# Altium schematic sheet 501_GridPos5.SchDoc
size A2; Organization: Greenfield Tech Solutions; Address1: Molendreef 33; Address2: Ossendrecht; Address3: 4641CS; Address4: The Netherlands; SheetNumber: 5; SheetTotal: 7
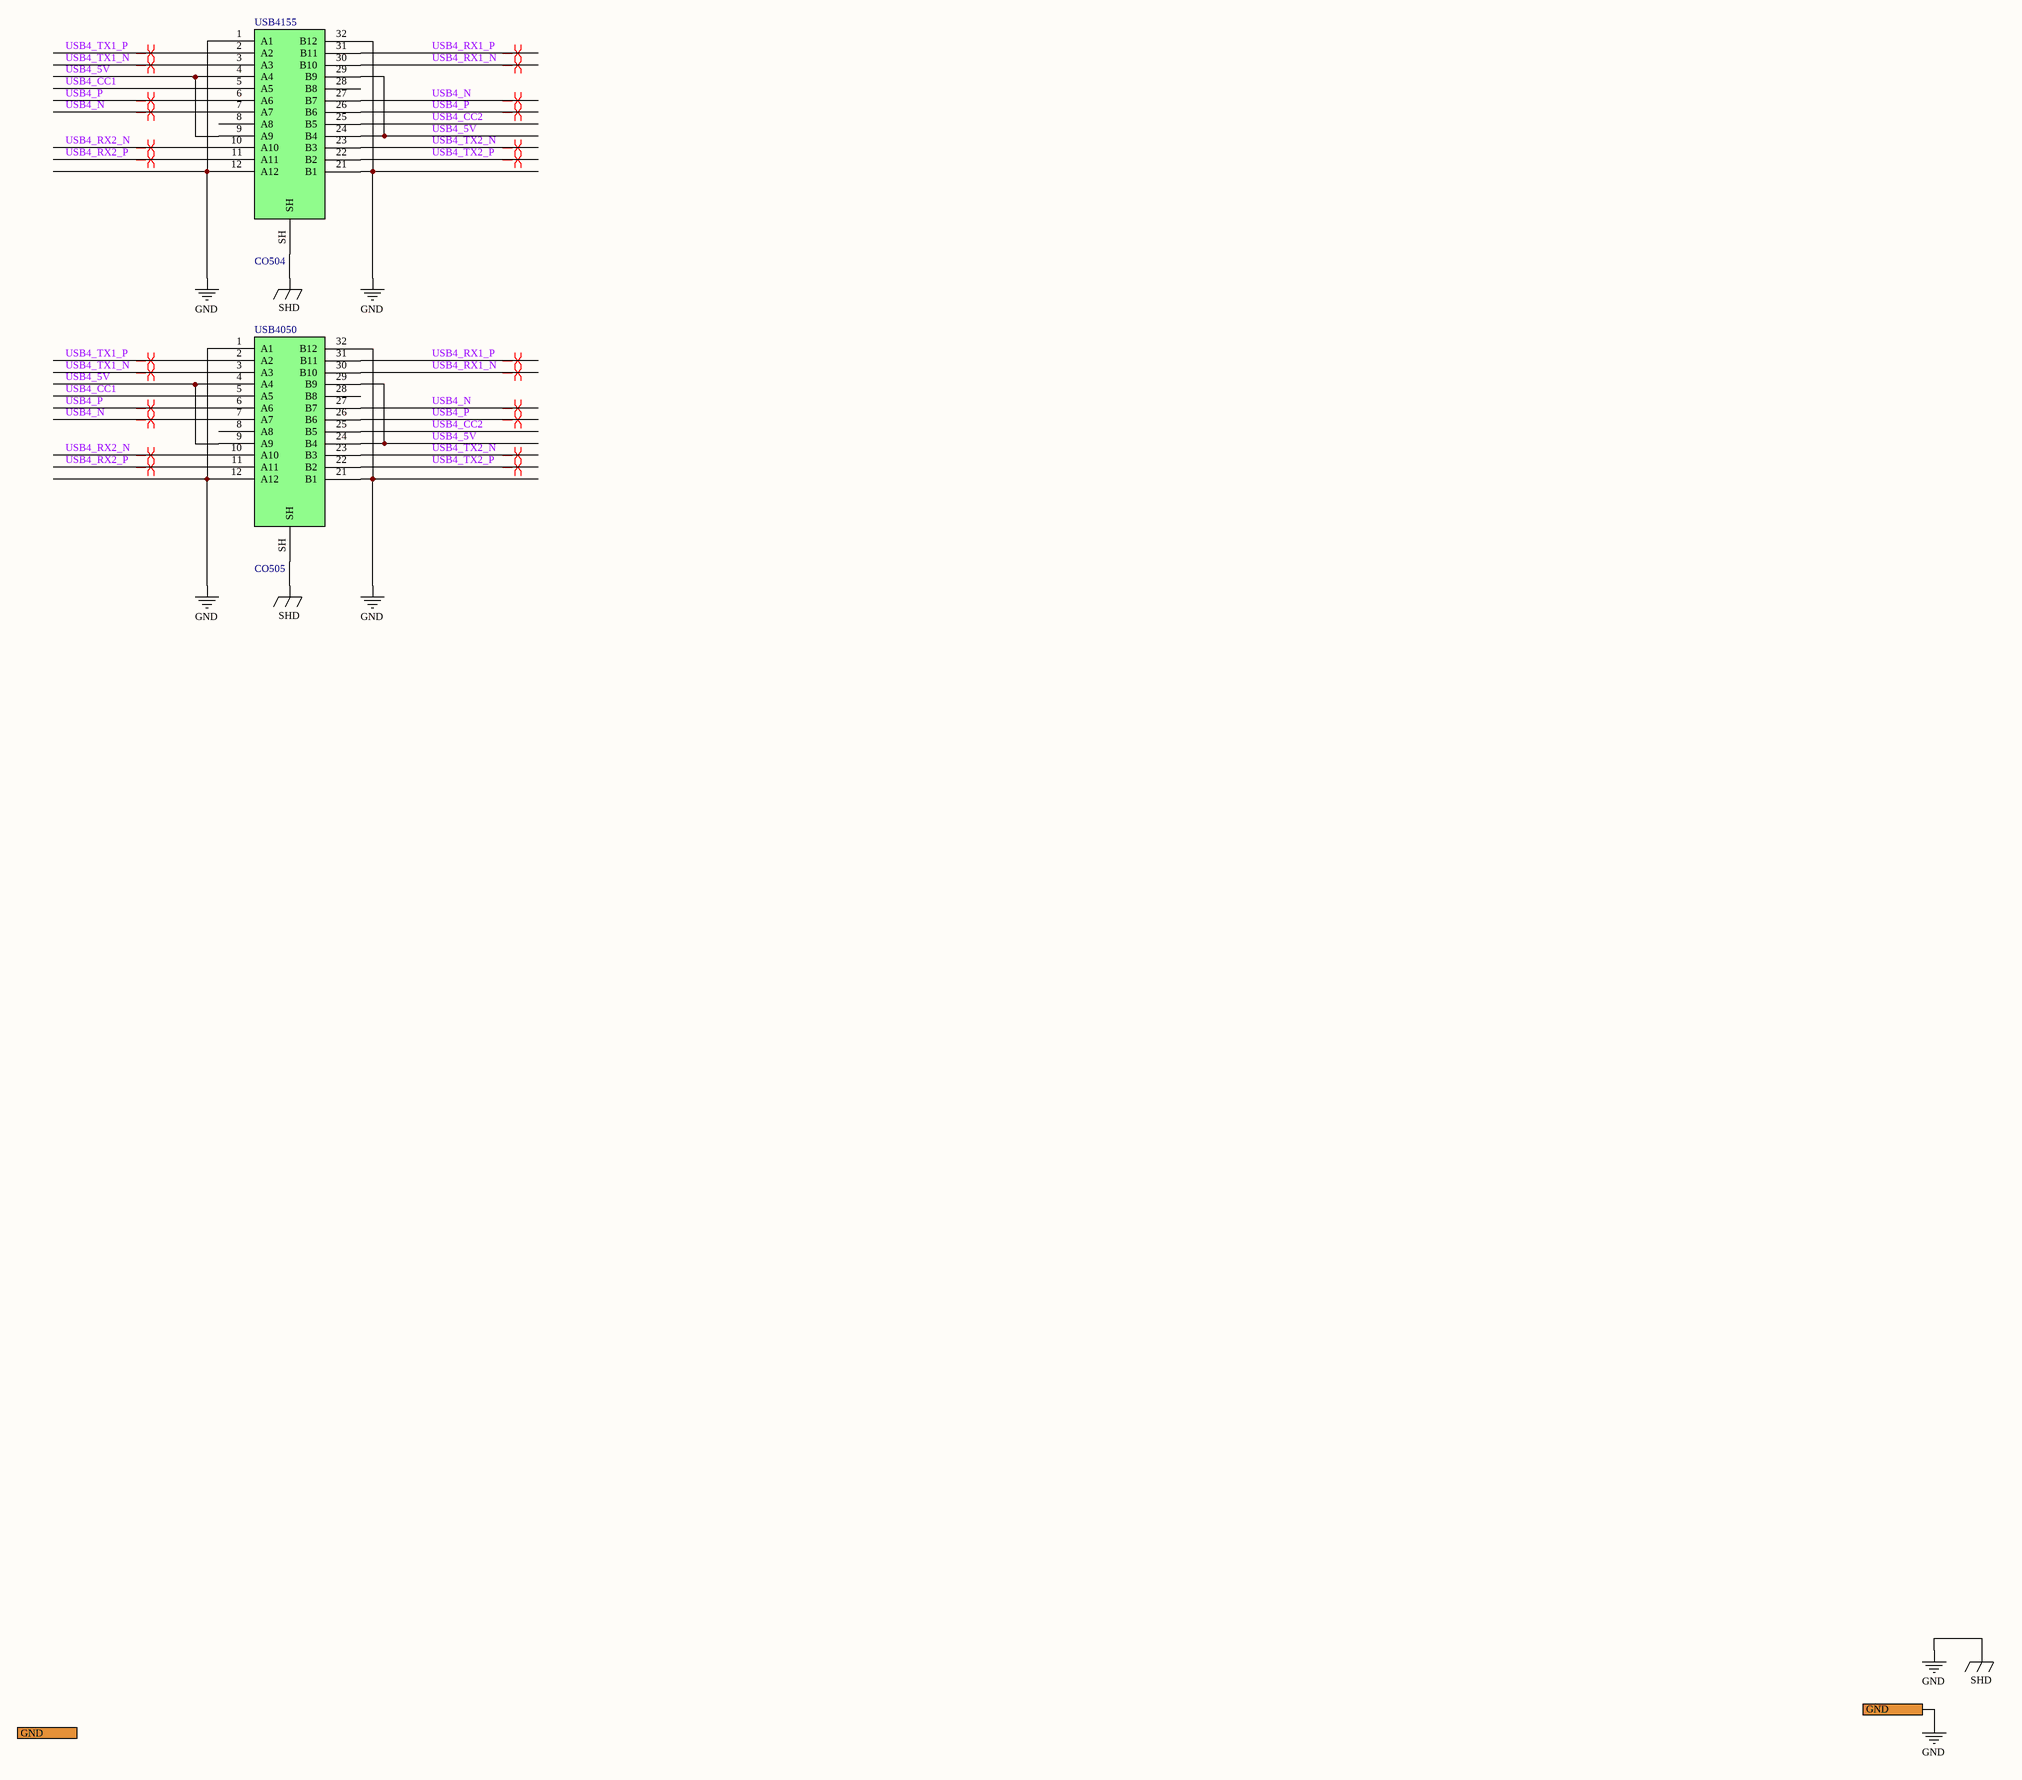
[diagram p0: 501_GridPos5.SchDoc]

## Parts
CO504  USB4155  [USB4155-03-C]
CO505  USB4050  [USB4050-30-A]

## Ports
GND

## Nets
GND: CO504.1(A1) CO504.12(A12) CO504.21(B1) CO504.32(B12) CO504.SH CO505.1(A1) CO505.12(A12) CO505.21(B1) CO505.32(B12) CO505.SH ; port GND  [also labelled SHD]
USB4_5V: CO504.4(A4) CO504.9(A9) CO504.24(B4) CO504.29(B9) CO505.4(A4) CO505.9(A9) CO505.24(B4) CO505.29(B9)
USB4_CC1: CO504.5(A5) CO505.5(A5)
USB4_CC2: CO504.25(B5) CO505.25(B5)
USB4_N: CO504.7(A7) CO504.27(B7) CO505.7(A7) CO505.27(B7)
USB4_P: CO504.6(A6) CO504.26(B6) CO505.6(A6) CO505.26(B6)
USB4_RX1_N: CO504.30(B10) CO505.30(B10)
USB4_RX1_P: CO504.31(B11) CO505.31(B11)
USB4_RX2_N: CO504.10(A10) CO505.10(A10)
USB4_RX2_P: CO504.11(A11) CO505.11(A11)
USB4_TX1_N: CO504.3(A3) CO505.3(A3)
USB4_TX1_P: CO504.2(A2) CO505.2(A2)
USB4_TX2_N: CO504.23(B3) CO505.23(B3)
USB4_TX2_P: CO504.22(B2) CO505.22(B2)

Not connected (* = marked no-connect by the designer): CO504 8(A8) 28(B8); CO505 8(A8) 28(B8)

## Layout directives
differential pair; differential pair class USB3: USB4_N, USB4_P, USB4_RX1_N, USB4_RX1_P, USB4_RX2_N, USB4_RX2_P, USB4_TX1_N, USB4_TX1_P, USB4_TX2_N, USB4_TX2_P

## Notes on the sheet
- Title
- Size:
- Date:
- File:
- A2
- Number:
- Time:
- Revision:
- Sheet
- of

## Library data of the parts
CO504 = CO0031: USB C connector Plug Horizontal; Part Number: CO0031; ID: 30; RefVal: USB4155; ManfactPart: USB4155-03-C
CO505 = CO0039: USB C connector Receptacle Horizontal; Part Number: CO0039; ID: 39; RefVal: USB4050; ManfactPart: USB4050-30-A